# Altium schematic sheet DC_DC_Converter.SchDoc: Power Supply
size A3; Author: ahorat / daniw; CompanyName: FSCH; DrawnBy: ahorat / daniw; Engineer: ahorat / daniw; Address1: FS Switzerland; Address2: Zeltweg 57; Address3: 8032 Zürich; SheetNumber: 4; SheetTotal: 9
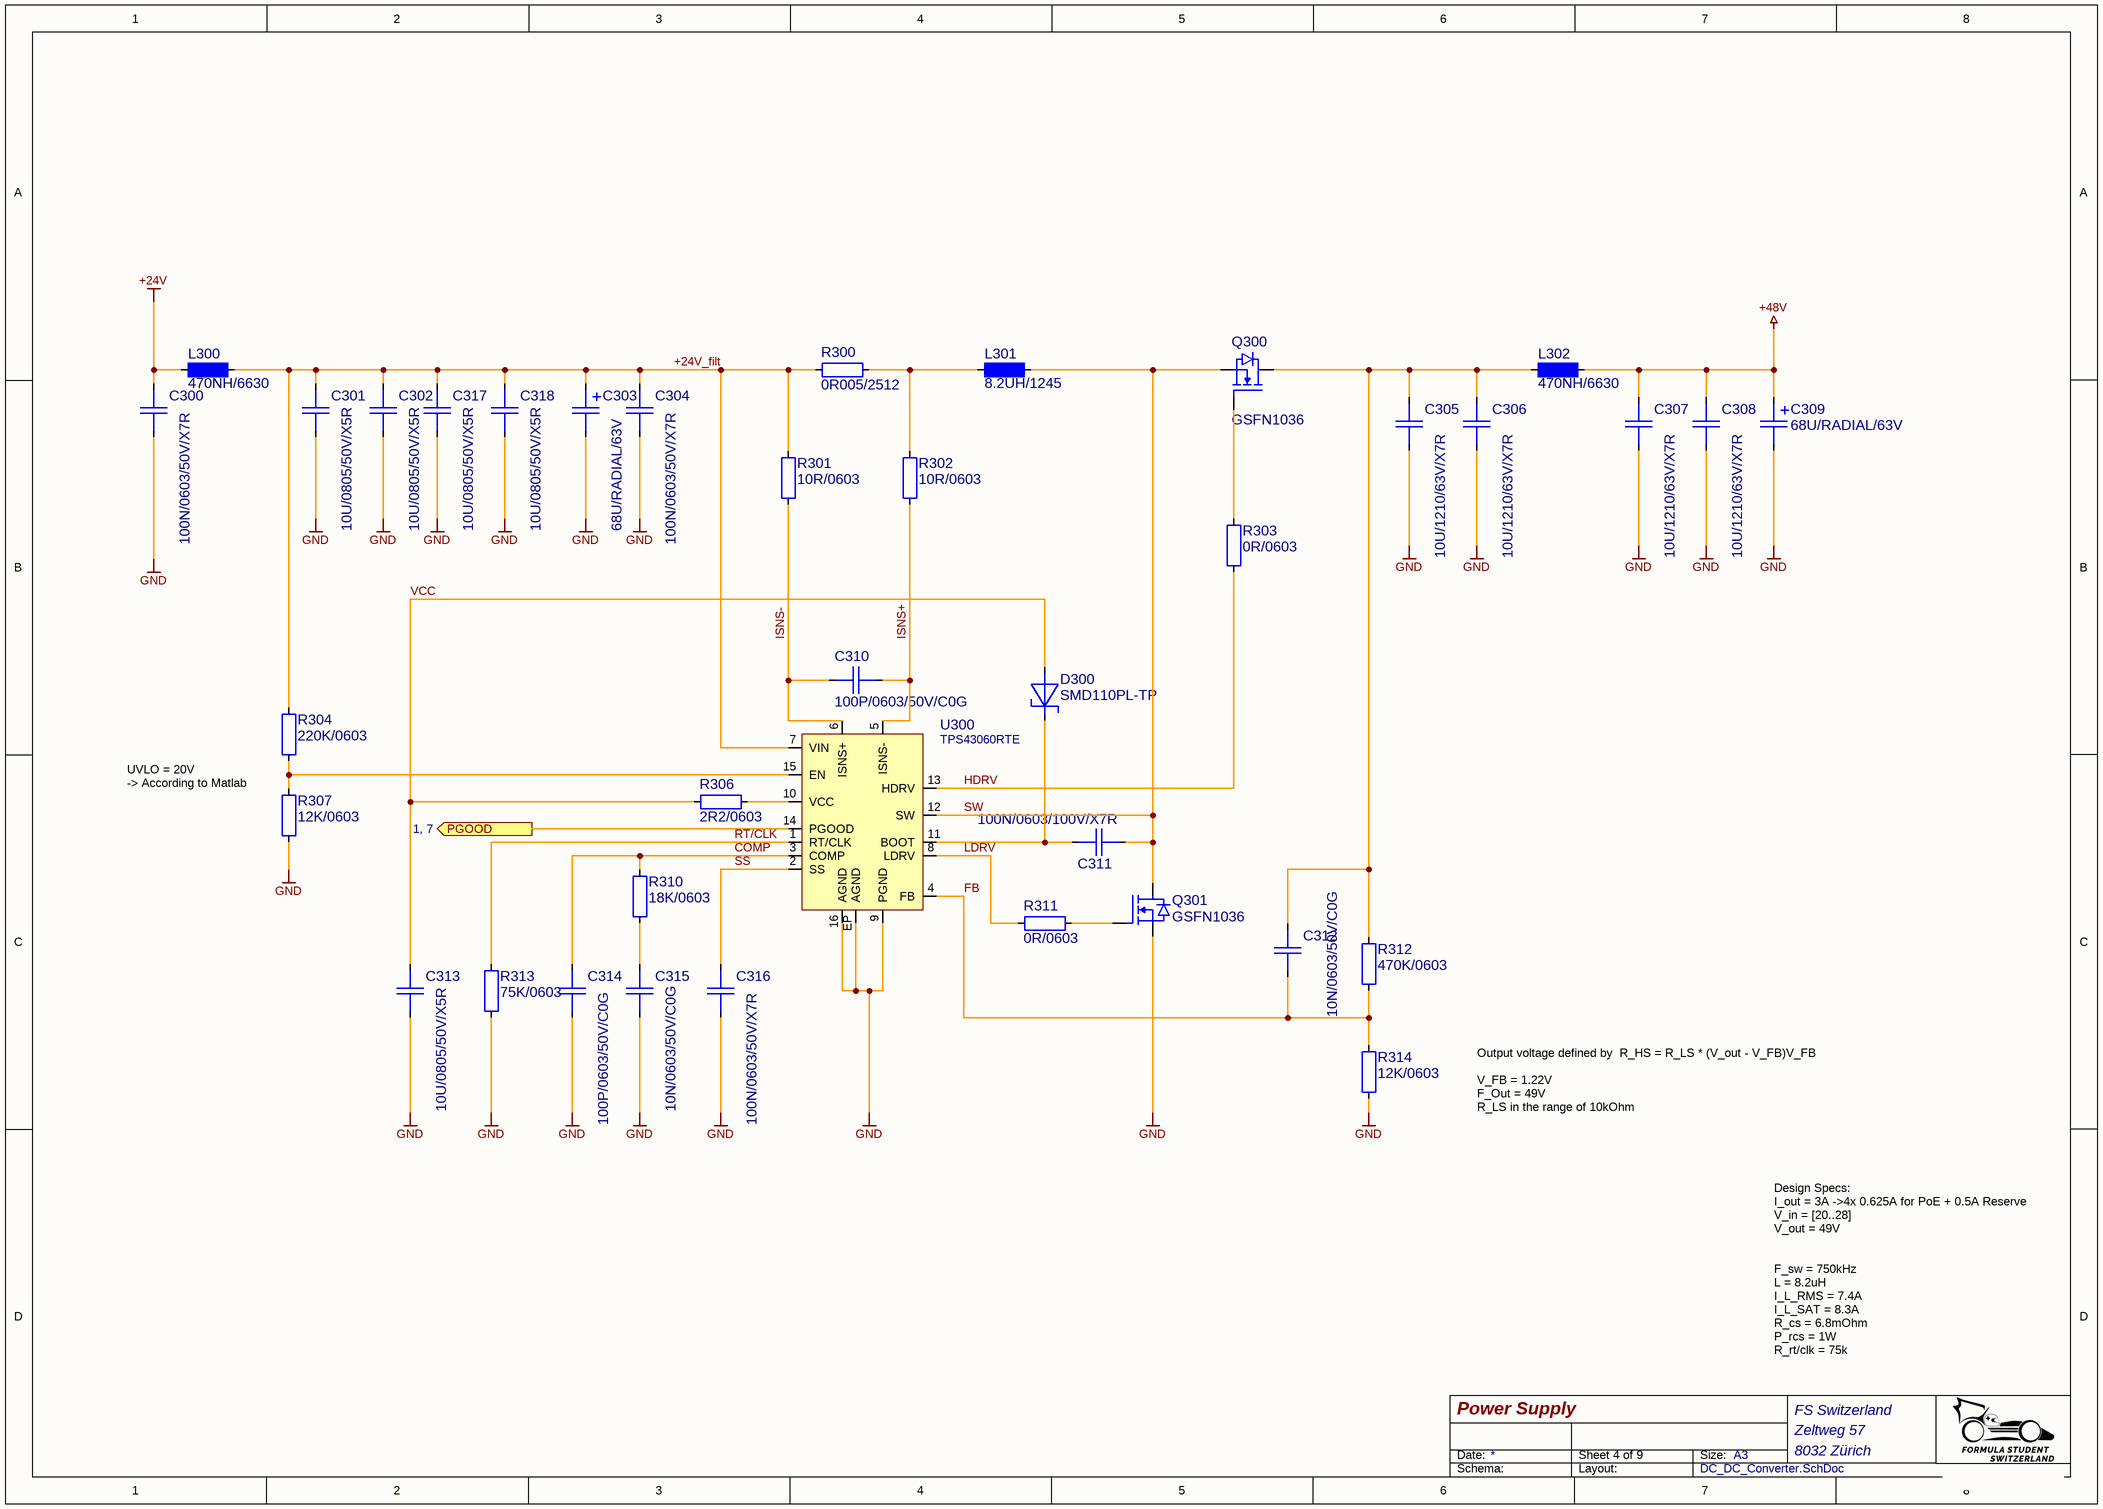
[diagram p0: DC_DC_Converter.SchDoc]

## Parts
C300  100N/0603/50V/X7R  [CAP0603_X7R]
C301  10U/0805/50V/X5R  [CAP0805_X7R]
C302  10U/0805/50V/X5R  [CAP0805_X7R]
C303  68U/RADIAL/63V  [CAP350P80X130]
C304  100N/0603/50V/X7R  [CAP0603_X7R]
C305  10U/1210/63V/X7R  [CAP1210_X7R]
C306  10U/1210/63V/X7R  [CAP1210_X7R]
C307  10U/1210/63V/X7R  [CAP1210_X7R]
C308  10U/1210/63V/X7R  [CAP1210_X7R]
C309  68U/RADIAL/63V  [CAP350P80X130]
C310  100P/0603/50V/C0G  [CAP0603_C0G]
C311  100N/0603/100V/X7R  [CAP0603_X7R]
C312  10N/0603/50V/C0G  [CAP0603_C0G]
C313  10U/0805/50V/X5R  [CAP0805_X7R]
C314  100P/0603/50V/C0G  [CAP0603_C0G]
C315  10N/0603/50V/C0G  [CAP0603_C0G]
C316  100N/0603/50V/X7R  [CAP0603_X7R]
C317  10U/0805/50V/X5R  [CAP0805_X7R]
C318  10U/0805/50V/X5R  [CAP0805_X7R]
D300  SMD110PL-TP  [SOD3718X125]
L300  470NH/6630  [INDM660730X30]
L301  8.2UH/1245  [INDM126126X47]
L302  470NH/6630  [INDM660730X30]
Q300  GSFN1036  [SON065P330X330X075-5-TH245X175]
Q301  GSFN1036  [SON065P330X330X075-5-TH245X175]
R300  0R005/2512  [R2512-0.65-WW]
R301  10R/0603  [R0603-0.40-WW]
R302  10R/0603  [R0603-0.40-WW]
R303  0R/0603  [R0603-0.40-WW]
R304  220K/0603  [R0603-0.40-WW]
R306  2R2/0603  [R0603-0.40-WW]
R307  12K/0603  [R0603-0.40-WW]
R310  18K/0603  [R0603-0.40-WW]
R311  0R/0603  [R0603-0.40-WW]
R312  470K/0603  [R0603-0.40-WW]
R313  75K/0603  [R0603-0.40-WW]
R314  12K/0603  [R0603-0.40-WW]
U300  TPS43060RTE  [QFN050P300X300X080-16-TH120X80]

## Ports
PGOOD (out, see 1, 7)

## Nets
+24V: C300.1 L300.1
+48V: C307.1 C308.1 C309.1 L302.2
GND: C300.2 C301.2 C302.2 C303.2 C304.1 C305.2 C306.2 C307.2 C308.2 C309.2 C313.2 C314.2 C315.2 C316.2 C317.2 C318.2 Q301.S(SOURCE) R307.2 R313.2 R314.2 U300.9(PGND) U300.16(AGND) U300.EP(AGND)
+24V_filt: C301.1 C302.1 C303.1 C304.2 C317.1 C318.1 L300.2 R300.1 R301.1 R304.1 U300.7(VIN)
COMP: C314.1 R310.1 U300.3(COMP)
FB: C312.2 R312.2 R314.1 U300.4(FB)
HDRV: R303.1 U300.13(HDRV)
ISNS+: C310.2 R302.2 U300.5(ISNS-)
ISNS-: C310.1 R301.2 U300.6(ISNS+)
LDRV: R311.1 U300.8(LDRV)
PGOOD: U300.14(PGOOD) ; port PGOOD
RT/CLK: R313.1 U300.1(RT/CLK)
SS: C316.1 U300.2(SS)
SW: C311.2 L301.2 Q300.S(SOURCE) Q301.D(DRAIN) U300.12(SW)
VCC: C313.1 D300.2 R306.1
NetC305_1: C305.1 C306.1 C312.1 L302.1 Q300.D(DRAIN) R312.1
NetC311_1: C311.1 D300.1 U300.11(BOOT)
NetC315_1: C315.1 R310.2
NetL301_1: L301.1 R300.2 R302.1
NetQ300_G: Q300.G(GATE) R303.2
NetQ301_G: Q301.G(GATE) R311.2
NetR304_2: R304.2 R307.1 U300.15(EN)
NetR306_2: R306.2 U300.10(VCC)

## Notes on the sheet
- UVLO = 20V
  -> According to Matlab
- Output voltage defined by  R_HS = R_LS * (V_out - V_FB)V_FB
  V_FB = 1.22V
  F_Out = 49V
  R_LS in the range of 10kOhm
- Design Specs:
  I_out = 3A ->4x 0.625A for PoE + 0.5A Reserve
  V_in = [20..28]
  V_out = 49V
  F_sw = 750kHz
  L = 8.2uH
  I_L_RMS = 7.4A
  I_L_SAT = 8.3A
  R_cs = 6.8mOhm
  P_rcs = 1W
  R_rt/clk = 75k
- Date:
- Size:
- A3
- Schema:
- Layout:

## Library data of the parts
C300 C304 C316 = 100N/0603/50V/X7R: CAP SM 0603 100nF 50V X7R; Manufacturer: GENERIC; Manufacturer 1: YAGEO; Manufacturer Part Number 1: CC0603KPX7R9BB104; Absolute Value: 1E-7; Eurocircuits GPN: GPC0603104; Part Number: 100N/0603/50V/X7R; Package: 0603; Value: 100nF; HelpURL: https://www.yageo.com/upload/media/product/app/datasheet/mlcc/upy-gphc_x7r_6_3v-to-250v.pdf; Supplier 1: Digi-Key; Supplier Part Number 1: 311-3567-1-ND; Manufacturer 2: YAGEO; Manufacturer Part Number 2: CC0603MRX7R9BB104; Supplier 2: Digi-Key; Supplier Part Number 2: 311-4110-1-ND; Supplier 3: LCSC; Supplier Part Number 3: C14663; JLC Type: Basic
C301 C302 C313 C317 C318 = 10U/0805/50V/X5R: CAP SM 0805 10uF 50V X5R; Manufacturer: GENERIC; Manufacturer 1: Murata Electronics; Manufacturer Part Number 1: GRM21BR61H106KE43K; Absolute Value: 1E-5; Eurocircuits GPN: GPN0805106-50-X5R; Part Number: 10U/0805/50V/X5R; Package: 0805; Value: 10uF; HelpURL: https://search.murata.co.jp/Ceramy/image/img/A01X/G101/ENG/GRM21BR61H106KE43-01A.pdf; Supplier 1: Digi-Key; Supplier Part Number 1: 490-GRM21BR61H106KE43KCT-ND; Manufacturer Part Number 3: GRM21BR61H106KE43L; Supplier 3: LCSC; Supplier Part Number 3: C440198; JLC Type: Basic
C303 C309 = 68U/RADIAL/63V: CAP THT 8C130 68UF ELKO 63V; Manufacturer: GENERIC; Manufacturer 1: Würth Elektronik; Manufacturer Part Number 1: 860020774014; Absolute Value: 6.8E-5; Part Number: 68U/RADIAL/63V; Package: RADIAL; Value: 68UF; HelpURL: https://www.we-online.com/components/products/datasheet/860020774014.pdf; Supplier 1: Digi-Key; Supplier Part Number 1: 732-8975-1-ND; Manufacturer Part Number 3: LKMD0901K680MF; Supplier 3: LCSC; Supplier Part Number 3: C443065
C305-C308 = 10U/1210/63V/X7R: CAP SM 1210 10uF 63V X7R; Manufacturer: GENERIC; Manufacturer 1: Samsung Electro-Mechanics; Manufacturer Part Number 1: CL32B106KMVNNWE; Absolute Value: 1E-5; Part Number: 10U/1210/63V/X7R; Package: 1210; Value: 10UF; HelpURL: https://mm.digikey.com/Volume0/opasdata/d220001/medias/docus/2124/CL32B106KMVNNWE_Spec.pdf; Supplier 1: Digi-Key; Supplier Part Number 1: 1276-7053-1-ND; Manufacturer Part Number 3: CGA1210X7R106K630RT; Supplier 3: LCSC; Supplier Part Number 3: C6120029
C310 C314 = 100P/0603/50V/C0G: CAP SM 0603 100pF 50V C0G; Manufacturer: GENERIC; Manufacturer 1: YAGEO; Manufacturer Part Number 1: CC0603JRNPO9BN101; Absolute Value: 1E-10; Eurocircuits GPN: GPC0603101-C0G; Part Number: 100P/0603/50V/C0G; Package: 0603; Value: 100pF; HelpURL: https://www.yageo.com/upload/media/product/productsearch/datasheet/mlcc/UPY-GP_NP0_16V-to-50V_18.pdf; Supplier 1: Digi-Key; Supplier Part Number 1: 311-1069-1-ND; Manufacturer 2: YAGEO; Manufacturer Part Number 2: CC0603KRNPO9BN101; Supplier 2: Digi-Key; Supplier Part Number 2: 311-3600-1-ND
C311 = 100N/0603/100V/X7R: CAP SM 0603 100nF 100V X7R; Manufacturer: GENERIC; Manufacturer 1: Samsung Electro-Mechanics; Manufacturer Part Number 1: CL10B104KC8NNNC; Absolute Value: 2.2E-8; Eurocircuits GPN: GPC0603104-100; Part Number: 100N/0603/100V/X7R; Package: 0603; Value: 100nF; HelpURL: https://mm.digikey.com/Volume0/opasdata/d220001/medias/docus/1296/CL10B104KC8NNNC_Spec.pdf; Supplier 1: Digi-Key; Supplier Part Number 1: 1276-6807-1-ND; Manufacturer Part Number 3: CGA0603X7R104K101JT; Supplier 3: LCSC; Supplier Part Number 3: C6119850
C312 C315 = 10N/0603/50V/C0G: CAP SM 0603 10nF 50V C0G; Manufacturer: GENERIC; Manufacturer 1: YAGEO; Manufacturer Part Number 1: CC0603JRNPO9BN103; Absolute Value: 1E-8; Eurocircuits GPN: GPC0603103-C0G; Part Number: 10N/0603/50V/C0G; Package: 0603; Value: 10nF; HelpURL: https://www.yageo.com/upload/media/product/productsearch/datasheet/mlcc/UPY-GP_NP0_16V-to-50V_18.pdf; Supplier 1: Digi-Key; Supplier Part Number 1: 311-3960-1-ND
D300 = SMD110PL-TP: Schottky 100 V 1A Oberflächenmontage SOD-123FL; Manufacturer: Micro Commercial Co; Absolute Value: 100V; Part Number: SMD110PL-TP; Package: SOD-123FL; Value: SMD110PL-TP; HelpURL: https://www.mccsemi.com/pdf/Products/SMD110PL-SMD1200PL(SOD-123FL).pdf; Manufacturer 1: Micro Commercial Co; Manufacturer Part Number 1: SMD110PL-TP; Supplier 1: Digikey; Supplier Part Number 1: SMD110PL-TPMSCT-ND
L300 L302 = 470NH/6630: FIXED IND 470NH 16.5 A 5.5 MOHM SMD; Manufacturer: GENERIC; Manufacturer 1: Pulse Electronics; Manufacturer Part Number 1: BMRA00060630R47MA1; Absolute Value: 4.7E-7; Part Number: 470NH/6630; Package: 6030; Value: 470NH; HelpURL: https://productfinder.pulseelectronics.com/api/open/part-attachments/datasheet/BMRA00060630R47MA1; Supplier 1: Digi-Key; Supplier Part Number 1: 553-BMRA00060630R47MA1CT-ND
L301 = 8.2UH/1245: FIXED IND 8.2UH  11.5 A 21.5 MOHM SMD; Manufacturer: GENERIC; Manufacturer 1: Bourns Inc.; Manufacturer Part Number 1: SRP1245C-8R2M; Absolute Value: 8.2E-6; Part Number: 8.2UH/1245; Package: 1245; HelpURL: https://www.bourns.com/docs/product-datasheets/srp1245c.pdf; Supplier 1: Digi-Key; Supplier Part Number 1: 118-SRP1245C-8R2MCT-ND; Value: 8.2UH
Q300 Q301 = GSFN1036: N-Kanal 100 V 35 A (Tc) 52W (Tc) Oberflächenmontage 8-PPAK (3,1x3,05); Manufacturer: Good-Ark Semiconductor; Part Number: GSFN1036; HelpURL: https://goodarksemi.com/docs/datasheets/mosfets/GSFN1036.pdf; Manufacturer 1: Good-Ark Semiconductor; Manufacturer Part Number 1: GSFN1036; Supplier 1: Digi-Key; Supplier Part Number 1: 4786-GSFN1036CT-ND; Package: 8-PowerVDFN
R300 = 0R005/2512: RES SM 2512 0R005; Manufacturer: GENERIC; Manufacturer 1: Ohmite; Manufacturer Part Number 1: MCS3264R005FER; Absolute Value: 0.005; Part Number: 0R005/2512; Package: 2512; Value: 0R005; HelpURL: https://www.ohmite.com/assets/docs/res_mcs.pdf?r=false; Supplier 1: Digi-Key; Supplier Part Number 1: MCS3264R005FERCT-ND
R301 R302 = 10R/0603: RES SM 0603 10R; Manufacturer: GENERIC; Manufacturer 1: YAGEO; Manufacturer Part Number 1: RC0603FR-1310RL; Absolute Value: 10; Eurocircuits GPN: GPR060310R; Part Number: 10R/0603; Package: 0603; Value: 10R; HelpURL: https://www.yageo.com/upload/media/product/app/datasheet/rchip/pyu-rc_group_51_rohs_l.pdf; Supplier 1: Digi-Key; Supplier Part Number 1: 13-RC0603FR-1310RLCT-ND; Manufacturer 2: YAGEO; Manufacturer Part Number 2: RC0603FR-1010RL; Supplier 2: Digi-Key; Supplier Part Number 2: 13-RC0603FR-1010RLCT-ND
R303 R311 = 0R/0603: RES SM 0603 0R; Manufacturer: GENERIC; Manufacturer 1: YAGEO; Manufacturer Part Number 1: RC0603FR-070RL; Absolute Value: 0; Eurocircuits GPN: GPR06030R; Part Number: 0R/0603; Package: 0603; Value: 0R; HelpURL: https://www.yageo.com/upload/media/product/app/datasheet/rchip/pyu-rc_group_51_rohs_l.pdf; Supplier 1: Digi-Key; Supplier Part Number 1: 311-0.0HRCT-ND; Manufacturer 2: YAGEO; Manufacturer Part Number 2: RC0603FR-130RL; Supplier 2: Digi-Key; Supplier Part Number 2: 13-RC0603FR-130RLCT-ND; Manufacturer 3: UNI-ROYAL(Uniroyal Elec); Manufacturer Part Number 3: 0603WAF0000T5E; Supplier 3: LCSC; Supplier Part Number 3: C21189; JLC Type: Basic
R304 = 220K/0603: RES SM 0603 220K; Manufacturer: GENERIC; Manufacturer 1: YAGEO; Manufacturer Part Number 1: RC0603FR-13220KL; Absolute Value: 220000; Eurocircuits GPN: GPR0603220K; Part Number: 220K/0603; Package: 0603; Value: 220K; HelpURL: https://www.yageo.com/upload/media/product/productsearch/datasheet/rchip/PYu-RC_Group_51_RoHS_L_12.pdf; Supplier 1: Digi-Key; Supplier Part Number 1: 13-RC0603FR-13220KLCT-ND; Manufacturer 2: YAGEO; Manufacturer Part Number 2: RC0603FR-10220KL; Supplier 2: Digi-Key; Supplier Part Number 2: 13-RC0603FR-10220KLCT-ND; Manufacturer 3: UNI-ROYAL(Uniroyal Elec); Manufacturer Part Number 3: 0603WAF2203T5E; Supplier 3: LCSC; Supplier Part Number 3: C22961; JLC Type: Basic
R306 = 2R2/0603: RES SM 0603 2R2; Manufacturer: GENERIC; Manufacturer 1: YAGEO; Manufacturer Part Number 1: RC0603FR-132R2L; Absolute Value: 2.2; Eurocircuits GPN: GPR06032R2; Part Number: 2R2/0603; Package: 0603; Value: 2R2; HelpURL: https://www.yageo.com/upload/media/product/productsearch/datasheet/rchip/PYu-RC_Group_51_RoHS_L_12.pdf; Supplier 1: Digi-Key; Supplier Part Number 1: 13-RC0603FR-132R2LCT-ND; Manufacturer 2: YAGEO; Manufacturer Part Number 2: RC0603FR-072R2L; Supplier 2: Digi-Key; Supplier Part Number 2: 311-2.2HRCT-ND
R307 R314 = 12K/0603: RES SM 0603 12K; Manufacturer: GENERIC; Manufacturer 1: YAGEO; Manufacturer Part Number 1: RC0603FR-1312KL; Absolute Value: 12000; Eurocircuits GPN: GPR060312K; Part Number: 12K/0603; Package: 0603; Value: 12K; HelpURL: https://www.yageo.com/upload/media/product/app/datasheet/rchip/pyu-rc_group_51_rohs_l.pdf; Supplier 1: Digi-Key; Supplier Part Number 1: 13-RC0603FR-1312KLCT-ND; Manufacturer 2: YAGEO; Manufacturer Part Number 2: RC0603FR-1012KL; Supplier 2: Digi-Key; Supplier Part Number 2: 13-RC0603FR-1012KLCT-ND
R310 = 18K/0603: RES SM 0603 18K; Manufacturer: GENERIC; Manufacturer 1: YAGEO; Manufacturer Part Number 1: RC0603FR-1318KL; Absolute Value: 18000; Eurocircuits GPN: GPR060318K; Part Number: 18K/0603; Package: 0603; Value: 18K; HelpURL: https://www.yageo.com/upload/media/product/productsearch/datasheet/rchip/PYu-RC_Group_51_RoHS_L_12.pdf; Supplier 1: Digi-Key; Supplier Part Number 1: 13-RC0603FR-1318KLCT-ND; Manufacturer 2: YAGEO; Manufacturer Part Number 2: RC0603FR-1018KL; Supplier 2: Digi-Key; Supplier Part Number 2: 13-RC0603FR-1018KLCT-ND
R312 = 470K/0603: RES SM 0603 470K; Manufacturer: GENERIC; Manufacturer 1: YAGEO; Manufacturer Part Number 1: RC0603FR-13470KL; Absolute Value: 470000; Eurocircuits GPN: GPR0603470K; Part Number: 470K/0603; Package: 0603; Value: 470K; HelpURL: https://www.yageo.com/upload/media/product/app/datasheet/rchip/pyu-rc_group_51_rohs_l.pdf; Supplier 1: Digi-Key; Supplier Part Number 1: 13-RC0603FR-13470KLCT-ND; Manufacturer 2: YAGEO; Manufacturer Part Number 2: RC0603FR-10470KL; Supplier 2: Digi-Key; Supplier Part Number 2: 13-RC0603FR-10470KLCT-ND
R313 = 75K/0603: RES SM 0603 75K; Manufacturer: GENERIC; Manufacturer 1: YAGEO; Manufacturer Part Number 1: RC0603FR-1375KL; Absolute Value: 75000; Eurocircuits GPN: GPR060375K; Part Number: 75K/0603; Package: 0603; Value: 75K; HelpURL: https://www.yageo.com/upload/media/product/app/datasheet/rchip/pyu-rc_group_51_rohs_l.pdf; Supplier 1: Digi-Key; Supplier Part Number 1: 13-RC0603FR-1375KLCT-ND; Manufacturer 2: YAGEO; Manufacturer Part Number 2: RC0603FR-1075KL; Supplier 2: Digi-Key; Supplier Part Number 2: 13-RC0603FR-1075KLCT-ND; Manufacturer 3: YAGEO; Manufacturer Part Number 3: RC0603FR-0775KL; Supplier 3: LCSC; Supplier Part Number 3: C114636; JLC Type: Basic
U300 = TPS43060RTE: TPS4306x Low Quiescent Current Synchronous Boost DC-DC Controller With Wide VIN Range; Manufacturer: Texas Instruments; Manufacturer Part Number 1: TPS43060RTER; Part Number: TPS43060RTE; Package: PWQFN-16; HelpURL: https://www.ti.com/lit/ds/symlink/tps43060.pdf; Manufacturer 1: Texas Instruments; Supplier 1: Digi-Key; Supplier Part Number 1: 296-39400-1-ND; Manufacturer 3: Texas Instruments; Manufacturer Part Number 3: TPS43060RTER; Supplier 3: LCSC; Supplier Part Number 3: C76516